# EAGLE design wemosd1pro-bme280 (EAGLE 9.6.2)
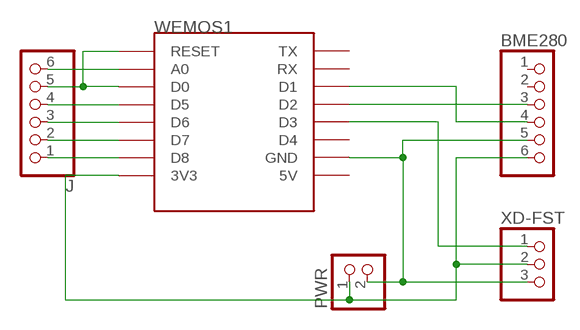
[diagram p0: schematic, sheet 1]

## Parts
BME280  PINHD-1X6  [1X06]
J  PINHD-1X6  [1X06]
PWR  PINHD-1X2  [1X02]
WEMOS1  WEMOS-D1-MINI  [WEMOS-D1-MINI]
XD-FST  PINHD-1X3  [1X03]

## Nets
N$1: BME280.6 PWR.1 WEMOS1.3V3 XD-FST.2
N$2: BME280.5 PWR.2 WEMOS1.GND XD-FST.3
N$3: J.5 WEMOS1.D0 WEMOS1.RESET
N$4: BME280.4 WEMOS1.D1
N$5: BME280.3 WEMOS1.D2
N$6: WEMOS1.D3 XD-FST.1
N$7: J.1 WEMOS1.D8
N$8: J.2 WEMOS1.D7
N$9: J.3 WEMOS1.D6
N$10: J.4 WEMOS1.D5
N$11: J.6 WEMOS1.A0
Unconnected: BME280.1 BME280.2 WEMOS1.5V WEMOS1.D4 WEMOS1.RX WEMOS1.TX

## Library data of the parts
BME280 J = pinhead:PINHD-1X6: PIN HEADER
PWR = pinhead:PINHD-1X2: PIN HEADER
WEMOS1 = esp8266modules:WEMOS-D1-MINI: WeMos.cc D1 mini ESP8266 module
XD-FST = pinhead:PINHD-1X3: PIN HEADER

## Board
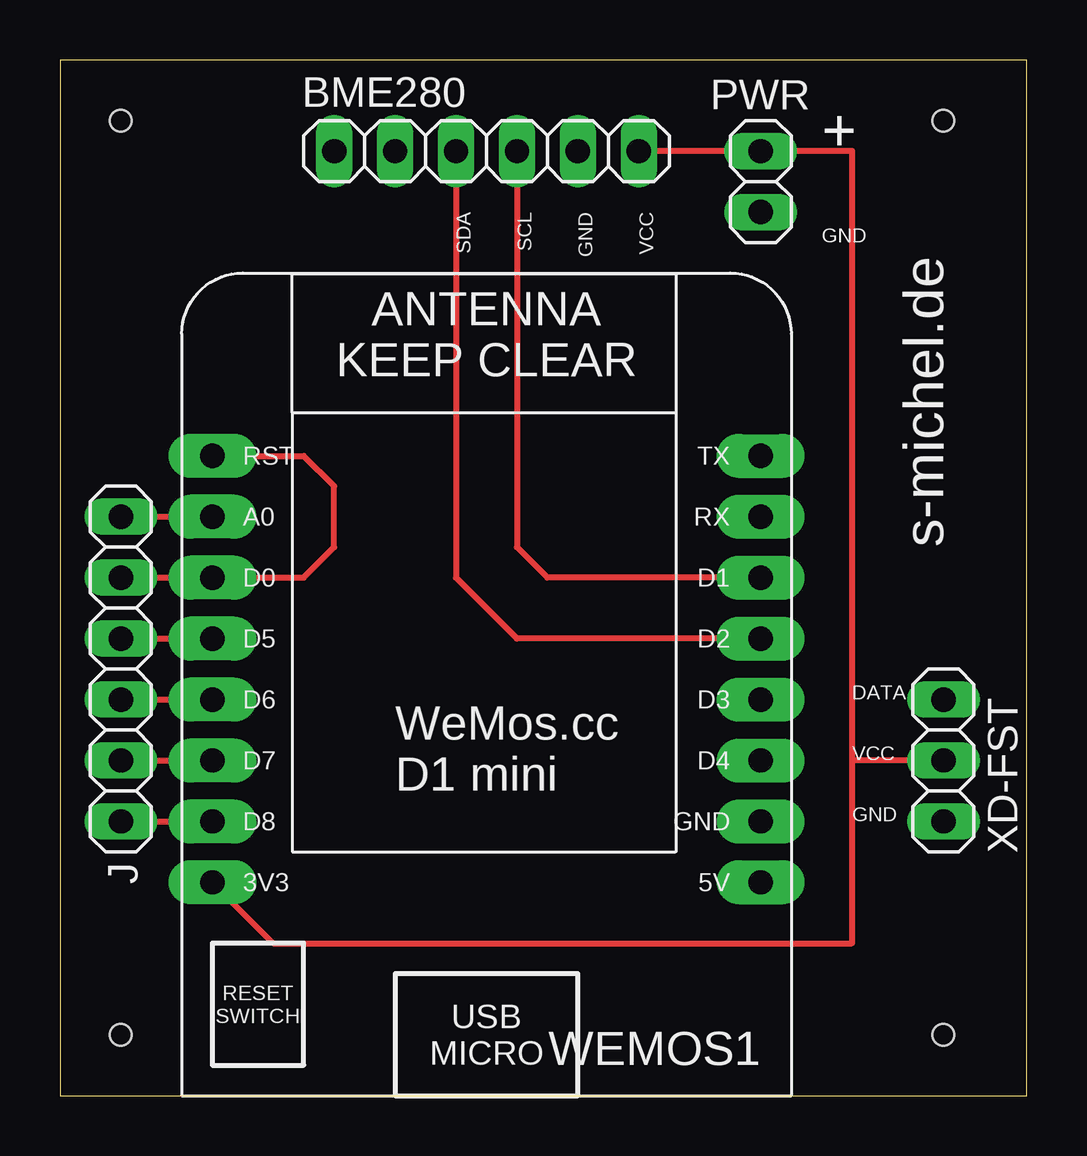
[diagram p1: board, top side]
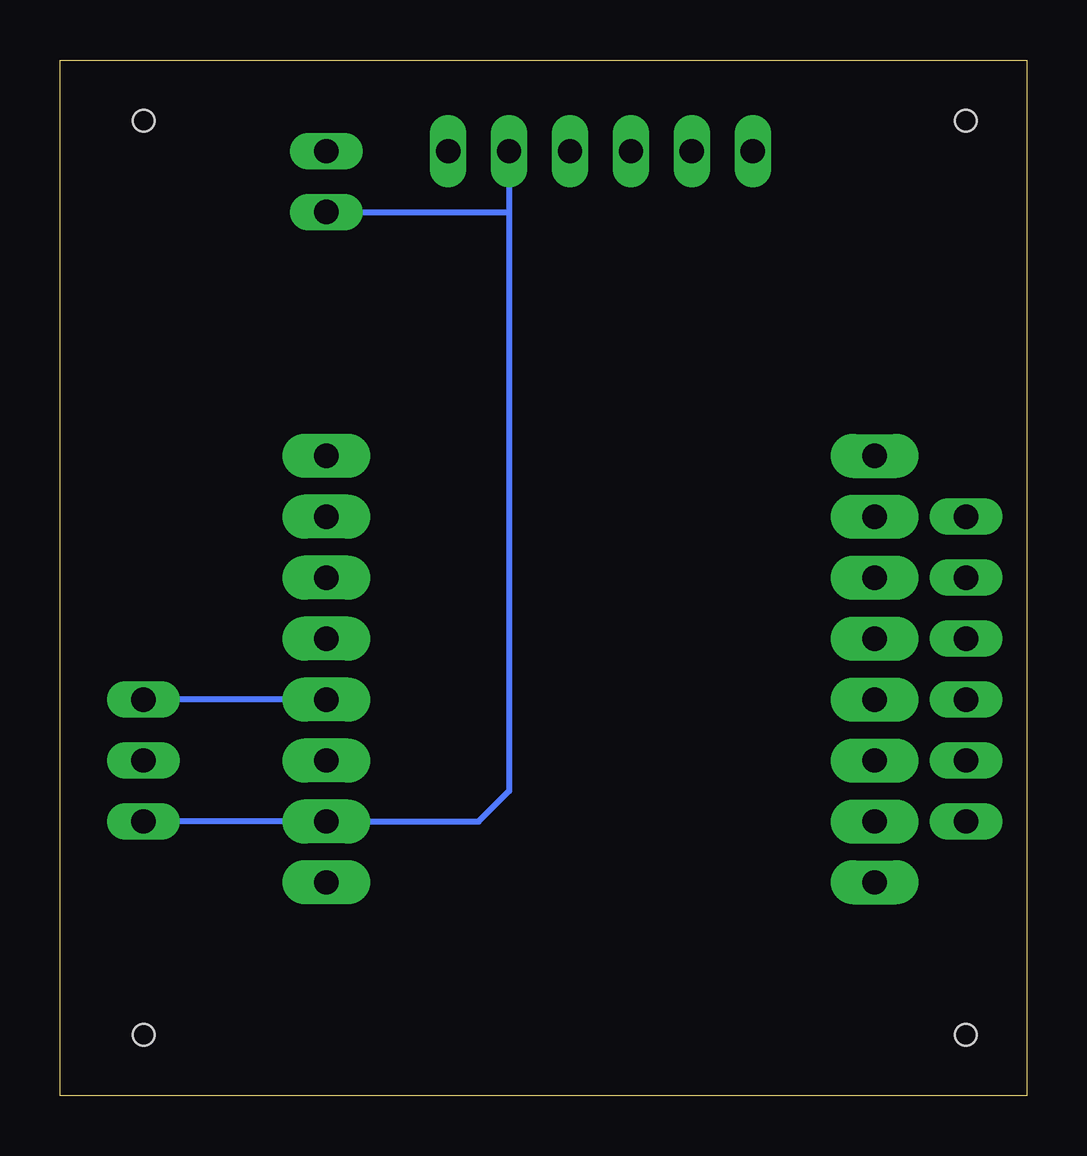
[diagram p2: board, bottom side, seen from below]

Size 40.31 x 43.17 mm. Coordinates in mm from the lower left corner, seen from the top.
Outline: 0,0 40.31,0 40.31,43.17 0,43.17 0,0
Copper layers (1*16): Top 0.035mm / dielectric 1.5mm / Bottom 0.035mm
Design rules "aisler_2_layer": minimum track width 0.1mm, minimum drill 0.2mm, track to track 0.1mm, track to pad 0.1mm, pad to pad 0.1mm, via to via 0.1mm, smd to smd 0.1mm, copper to edge 0.2mm, drill to drill 0.21mm, minimum pad ring 0.25mm, minimum via ring 0.15mm, stop-mask expansion 0mil, vias tented up to drill 0mil, thermal gap 10mil
Holes 0.9 mm at 2.54,40.64 36.83,40.64 36.83,2.54 2.54,2.54

### Footprints (pad centres in the part's own frame; a part is rotated, then mirrored left to right if it is on the bottom)
1X06 = drill 1.016 long: 1 -6.35,0; 2 -3.81,0; 3 -1.27,0; 4 1.27,0; 5 3.81,0; 6 6.35,0
1X02 = drill 1.016 long: 1 -1.27,0; 2 1.27,0
WEMOS-D1-MINI = drill 1.016 pad 1.829 long: 3V3 -10.16,-10.16; 5V 12.7,-10.16; A0 -10.16,5.08; D0 -10.16,2.54; D1 12.7,2.54; D2 12.7,0; D3 12.7,-2.54; D4 12.7,-5.08; D5 -10.16,0; D6 -10.16,-2.54; D7 -10.16,-5.08; D8 -10.16,-7.62; GND 12.7,-7.62; RESET -10.16,7.62; RX 12.7,5.08; TX 12.7,7.62
1X03 = drill 1.016 long: 1 -2.54,0; 2 0,0; 3 2.54,0

### Placement (x,y rotation side)
BME280  17.78,39.37 0 top
J  2.54,17.78 90 top
PWR  29.21,38.1 270 top
WEMOS1  16.51,19.05 0 top
XD-FST  36.83,13.97 270 top

### Tracks (layer width: path | path; a pad name or v marks a point on that pad's centre or on a via)
N$1
  Top 0.254: WEMOS1.3V3 8.89,6.35 33.02,6.35 33.02,13.97 | 33.02,13.97 33.02,39.37 BME280.6 PWR.1 | XD-FST.2 33.02,13.97
N$2
  Bottom 0.254: XD-FST.3 WEMOS1.GND 22.86,11.43 21.59,12.7 21.59,36.83 | BME280.5 21.59,36.83 | PWR.2 21.59,36.83
N$3
  Top 0.254: WEMOS1.RESET 10.16,26.67 11.43,25.4 11.43,22.86 10.16,21.59 WEMOS1.D0 J.5
N$4
  Top 0.254: WEMOS1.D1 20.32,21.59 19.05,22.86 BME280.4
N$5
  Top 0.254: WEMOS1.D2 19.05,19.05 16.51,21.59 BME280.3
N$6
  Bottom 0.254: WEMOS1.D3 XD-FST.1
N$7
  Top 0.254: J.1 WEMOS1.D8
N$8
  Top 0.254: J.2 WEMOS1.D7
N$9
  Top 0.254: J.3 WEMOS1.D6
N$10
  Top 0.254: J.4 WEMOS1.D5
N$11
  Top 0.254: J.6 WEMOS1.A0

### Text on the board
tNames: + | SDA | SCL | GND | VCC | GND | s-michel.de | DATA | VCC | GND